# Altium schematic sheet Ethernet.SchDoc: NH Speaker Sensor 16CH 2.3_C
size A3; Revision: 2.3; SheetNumber: 2; SheetTotal: 6
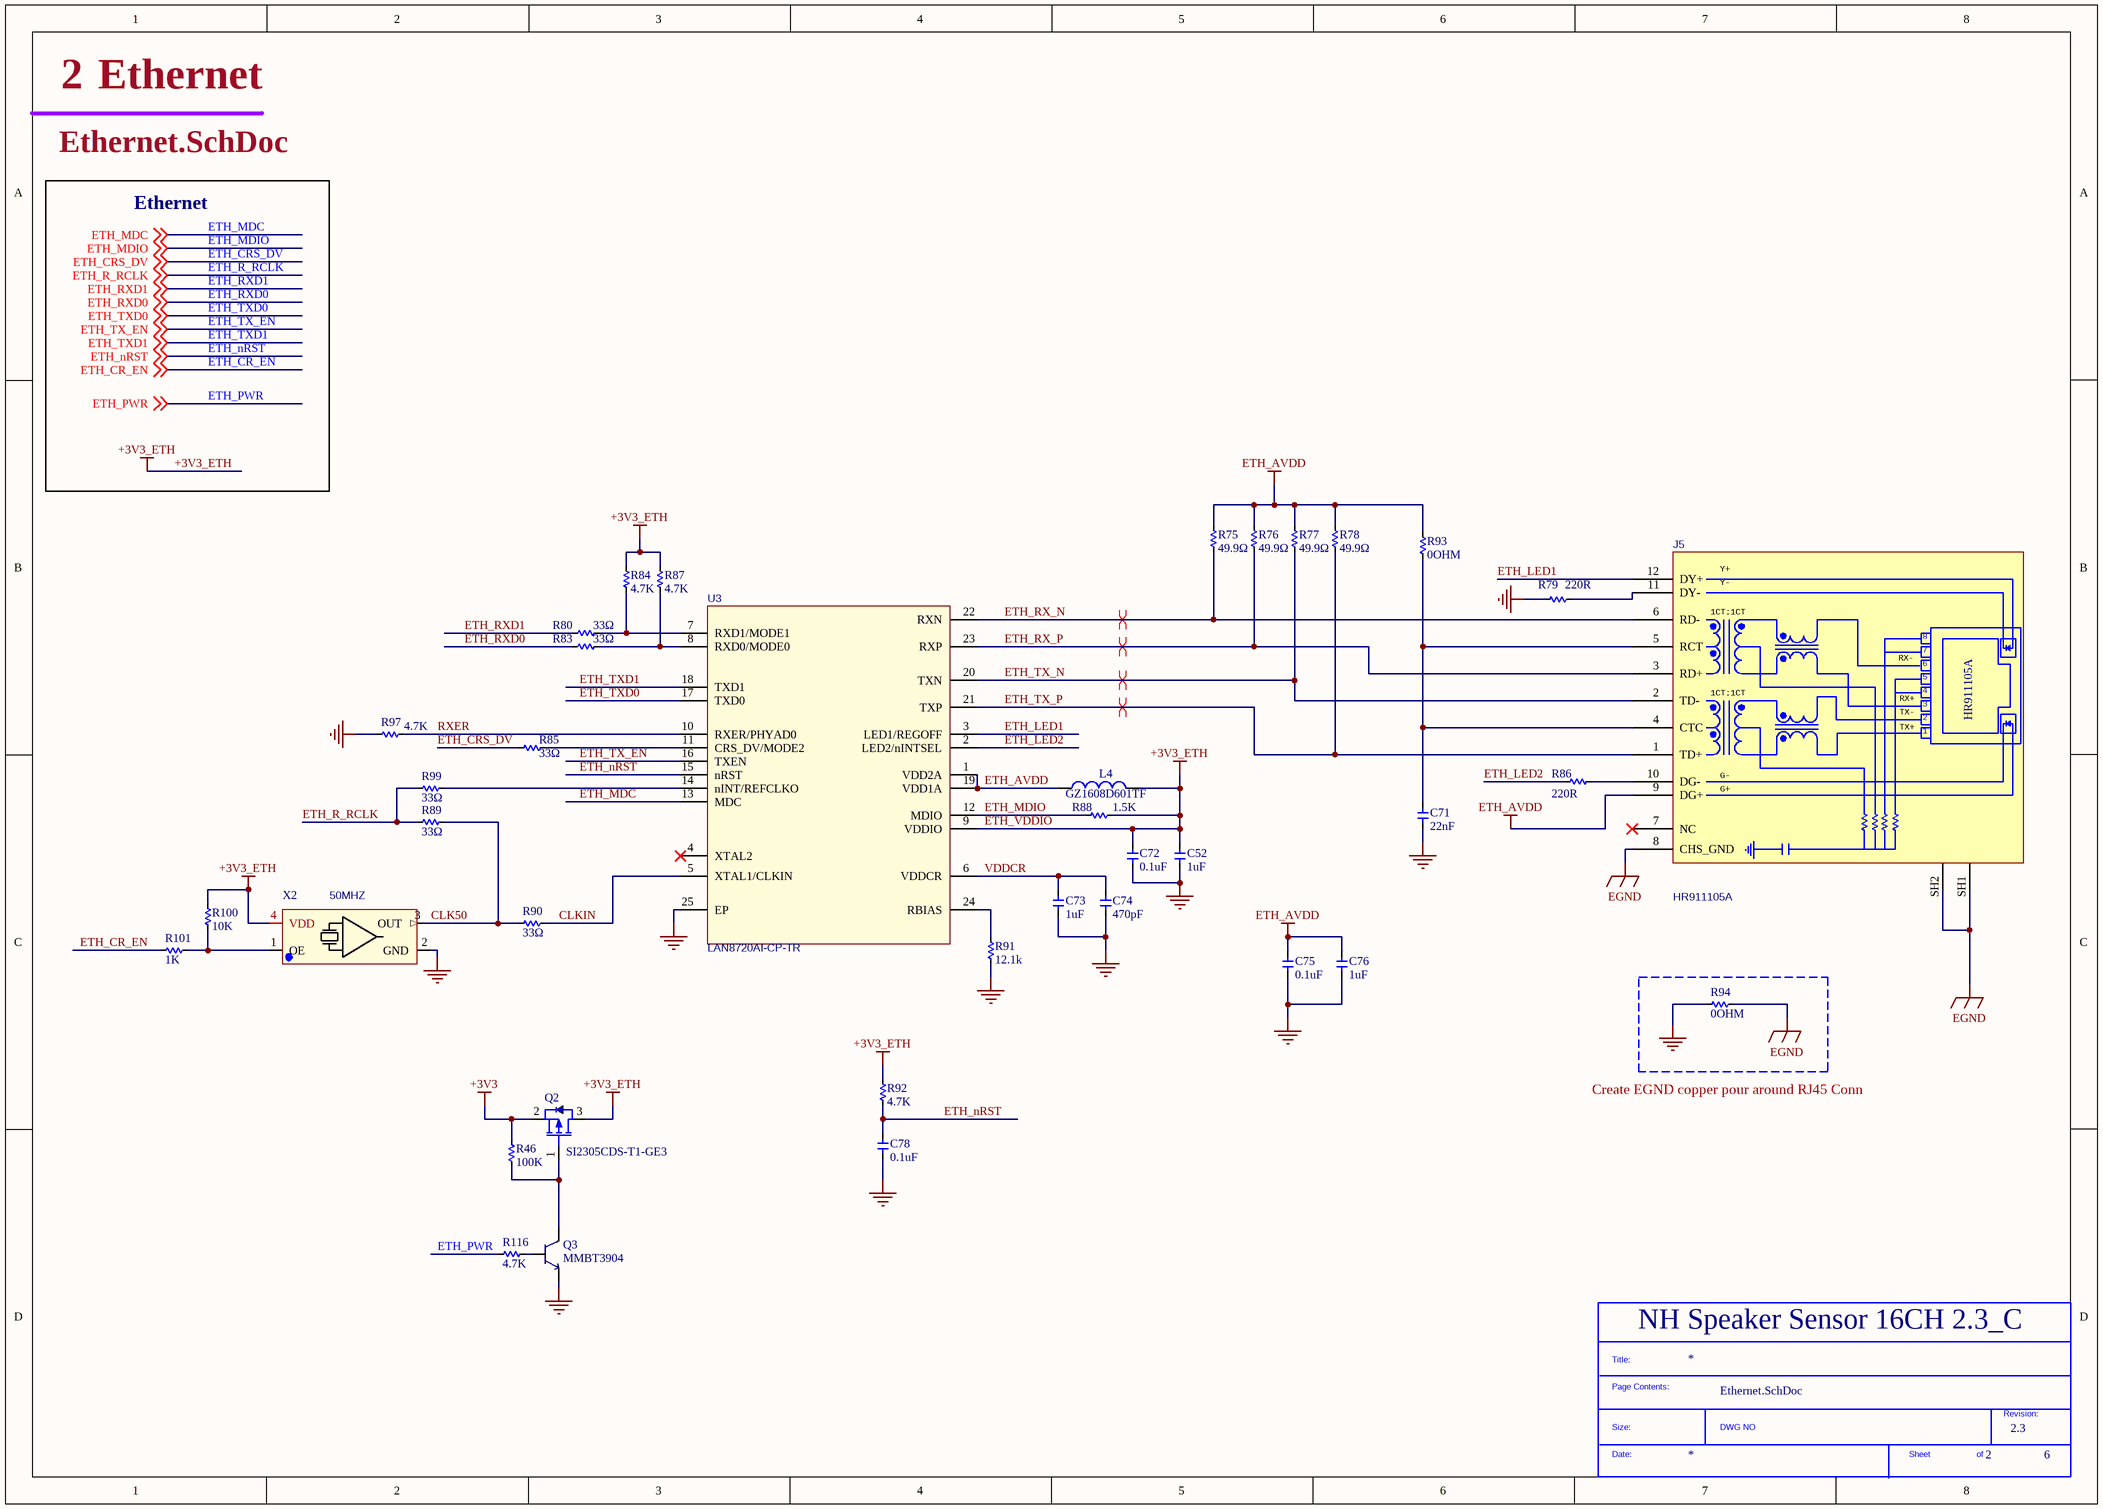
[diagram p0: Ethernet.SchDoc]

## Parts
*?  SDTitleBlock  (value not drawn)  (graphical)
C52  1uF  [C_0603]
C71  22nF  [C_0603]
C72  0.1uF  [C_0603]
C73  1uF  [C_0603]
C74  470pF  [C_0603]
C75  0.1uF  [C_0603]
C76  1uF  [C_0603]
C78  0.1uF  [C_0603]
J5  HR911105A  [RJ45-TH_HR911105A]
L4  GZ1608D601TF  [L_0603]
Q2  SI2305CDS-T1-GE3  [SOT-23-3_L2.9-W1.6-P1.90-LS2.8-BR]
Q3  MMBT3904  [SOT-23-3_L2.9-W1.3-P1.90-LS2.4-BR]
R46  100K  [R_0603]
R75  49.9Ω  [R_0603]
R76  49.9Ω  [R_0603]
R77  49.9Ω  [R_0603]
R78  49.9Ω  [R_0603]
R79  220R  [R_0603]
R80  33Ω  [R_0603]
R83  33Ω  [R_0603]
R84  4.7K  [R_0603]
R85  33Ω  [R_0603]
R86  220R  [R_0603]
R87  4.7K  [R_0603]
R88  1.5K  [R_0603]
R89  33Ω  [R_0603]
R90  33Ω  [R_0603]
R91  12.1k  [R_0603]
R92  4.7K  [R_0603]
R93  0OHM  [R_0603]
R94  0OHM  [R_0603]
R97  4.7K  [R_0603]
R99  33Ω  [R_0603]
R100  10K  [R_0603]
R101  1K  [R_0603]
R116  4.7K  [R_0603]
U3  LAN8720AI-CP-TR  [QFN-24_L4.0-W4.0-P0.50-BL-EP2.6]
X2  50MHZ  [SMD-3225_4P]

## Nets
+3V3: Q2.2(S) R46.1
+3V3_ETH: C52.2 C72.2 L4.2 Q2.3(D) R84.1 R87.1 R88.1 R92.1 R100.1 U3.9(VDDIO) X2.4(VDD)  [also labelled ETH_VDDIO]
EGND: J5.8(CHS_GND) J5.SH1 J5.SH2 R94.1
ETH_AVDD: C75.2 C76.2 J5.9(DG+) L4.1 R75.1 R76.1 R77.1 R78.1 R93.1 U3.1(VDD2A) U3.19(VDD1A)
GND: C52.1 C71.1 C72.1 C73.1 C74.1 C75.1 C76.1 C78.1 Q3.2 R79.2 R91.2 R94.2 R97.2 U3.25(EP) X2.2(GND)
CLK50: R89.1 R90.2 X2.3(OUT)
CLKIN: R90.1 U3.5(XTAL1/CLKIN)
ETH_CR_EN: R101.2 ; off-sheet ETH_CR_EN
ETH_CRS_DV: R85.2 ; off-sheet ETH_CRS_DV
ETH_LED1: J5.12(DY+) U3.3(LED1/REGOFF)
ETH_LED2: R86.2 U3.2(LED2/nINTSEL)
ETH_MDC: U3.13(MDC) ; off-sheet ETH_MDC
ETH_MDIO: R88.2 U3.12(MDIO) ; off-sheet ETH_MDIO
ETH_nRST: C78.2 R92.2 U3.15(nRST) ; off-sheet ETH_nRST
ETH_PWR: R116.2 ; off-sheet ETH_PWR
ETH_R_RCLK: R89.2 R99.2 ; off-sheet ETH_R_RCLK
ETH_RX_N: J5.6(RD-) R75.2 U3.22(RXN)
ETH_RX_P: J5.3(RD+) R76.2 U3.23(RXP)
ETH_RXD0: R83.2 ; off-sheet ETH_RXD0
ETH_RXD1: R80.2 ; off-sheet ETH_RXD1
ETH_TX_EN: U3.16(TXEN) ; off-sheet ETH_TX_EN
ETH_TX_N: J5.2(TD-) R77.2 U3.20(TXN)
ETH_TX_P: J5.1(TD+) R78.2 U3.21(TXP)
ETH_TXD0: U3.17(TXD0) ; off-sheet ETH_TXD0
ETH_TXD1: U3.18(TXD1) ; off-sheet ETH_TXD1
RXER: R97.1 U3.10(RXER/PHYAD0)
VDDCR: C73.2 C74.2 U3.6(VDDCR)
NetC71_2: C71.2 J5.4(CTC) J5.5(RCT) R93.2
NetJ5_10: J5.10(DG-) R86.1
NetJ5_11: J5.11(DY-) R79.1
NetQ2_1: Q2.1(G) Q3.3 R46.2
NetQ3_1: Q3.1 R116.1
NetR80_1: R80.1 R84.2 U3.7(RXD1/MODE1)
NetR83_1: R83.1 R87.2 U3.8(RXD0/MODE0)
NetR85_1: R85.1 U3.11(CRS_DV/MODE2)
NetR91_1: R91.1 U3.24(RBIAS)
NetR99_1: R99.1 U3.14(nINT/REFCLKO)
NetR100_2: R100.2 R101.1 X2.1(OE)

Not connected (* = marked no-connect by the designer): J5 7(NC)*; U3 4(XTAL2)*

## Layout directives
differential pair: ETH_RX_N, ETH_RX_P, ETH_TX_N, ETH_TX_P

## Notes on the sheet
- Ethernet
- Create EGND copper pour around RJ45 Conn
- (in symbol RJ45_HR911105A) Y+; Y-; 1CT:1CT; RX-; RX+; TX-; TX+; G-; G+
- (in symbol SDTitleBlock) Title:; Page Contents:; Revision:; Size:; DWG NO; Date:; Sheet; of

## Library data of the parts
*? = SDTitleBlock: TitleBlock
C52 C73 C76 = CL10A105KB8NNNC: 1UF 50V 0603 ROHS; Manufacturer: Samsung Electro-Mechanics; Manufacturer Part Number: CL10A105KB8NNNC; Package: 0603; LCSC Part Number: C15849; ComponentLink1Description: Digikey Link; ComponentLink1URL: https://www.digikey.com/en/products/detail/samsung-electro-mechanics/CL10A105KB8NNNC/3887518?s=N4IgTCBcDaIMIBkCMAGAgqgrAaQEIA4A5YuEAXQF8g; ComponentLink2Description: LCSC Link; ComponentLink2URL: https://jlcpcb.com/parts/componentSearch?searchTxt=10k%200603; Assembly Type: SMT Assembly
C71 = CL10B223KB8NNNC: 22nF 50V 0603 Multilayer Ceramic Capacitors MLCC - SMD/SMT ROHS; Manufacturer: Samsung Electro-Mechanics; Manufacturer Part Number: CL10B223KB8NNNC; Package: 0603; LCSC Part Number: C21122; ComponentLink1Description: Digikey Link; ComponentLink2Description: LCSC Link; ComponentLink2URL: https://jlcpcb.com/parts/componentSearch?searchTxt=10k%200603; Assembly Type: SMT Assembly
C72 C75 C78 = CC0603KRX7R9BB104: 100NF 50V 0603 ROHS; Manufacturer: YAGEO; Manufacturer Part Number: CC0603KRX7R9BB104; Package: 0603; LCSC Part Number: C14663; ComponentLink1Description: Digikey Link; ComponentLink1URL: https://www.digikey.com/en/products/detail/yageo/CC0603KRX7R9BB104/2103082?s=N4IgTCBcDaIMwEYEFoFwCzuWZA5AIiALoC%2BQA; ComponentLink2Description: LCSC Link; ComponentLink2URL: https://jlcpcb.com/parts/componentSearch?searchTxt=10k%200603; Assembly type: SMT Assembly
C74 = 0603B471K500NT: 470pF 50V 0603 Multilayer Ceramic Capacitors MLCC - SMD/SMT ROHS; Manufacturer: FH(Guangdong Fenghua Advanced Tech); Manufacturer Part Number: 0603B471K500NT; Package: 0603; LCSC Part Number: C1620; ComponentLink1Description: Digikey Link; ComponentLink2Description: LCSC Link; ComponentLink2URL: https://jlcpcb.com/parts/componentSearch?searchTxt=10k%200603; Assembly Type: SMT Assembly
J5 = RJ45_HR911105A: RJ45 12 1 Green - Yellow Through Hole Ethernet Connectors/Modular Connectors (RJ45 RJ11) RoHS; Manufacturer: HANRUN; Manufacturer Part Number: HR911105A; LCSC Part Number: C12074; Package: Through Hole; Assembly Type: Hand Soldering
L4 = FB_GZ1608D601TF: 600Ω @ 100MHz 1 200mA 450mΩ 0603 Ferrite Beads ROHS; Manufacturer: Sunlord; Manufacturer Part Number: GZ1608D601TF; LCSC Part Number: C1002; Package: 0603; Assembly Type: SMT Assembly
Q2 = SI2305CDS-T1-GE3: SI2305CDS-T1-GE3 8V 5.8A 35mΩ@4.5V,4.4A P Channel SOT-23  MOSFETs ROHS; Manufacturer: Vishay Intertech; Manufacturer Part Number: SI2305CDS-T1-GE3; LCSC Part Number: C37577; Package: SOT-23-3; Assembly Type: SMT Assembly
Q3 = MMBT3904: MMBT3904 TRANSISTORS (NPN/PNP) NPN 200MA 40V SOT-23(SOT-23-3) ROHS; Manufacturer: Changjiang Electronics Tech (CJ); Manufacturer Part Number: MMBT3904; LCSC Part Number: C20526; Package: SOT-23-3; Assembly Type: SMT Assembly
R46 = 0603WAF1003T5E: 100KOHMS ±1% 1/10W 0603 ROHS; Manufacturer: Uniroyal Elec; Manufacturer Part Number: 0603WAF1003T5E; LCSC Part Number: C25803; Package: 0603; Assembly Type: SMT Assembly
R75-R78 = 0603WAF499JT5E: 49.9OHM ±1% ±1% 0.1W ±200ppm/℃ 0603 Chip Resistor - Surface Mount RoHS; Manufacturer: Uniroyal Elec; Manufacturer Part Number: 0603WAF499JT5E; LCSC Part Number: C23185; Package: 0603; Assembly Type: SMT Assembly
R79 R86 = 0603WAF2200T5E: 220R 22OHMS ±1% 1/10W 0603 ROHS; Manufacturer: Uniroyal Elec; Manufacturer Part Number: 0603WAF2200T5E; LCSC Part Number: C22962; Package: 0603; Assembly Type: SMT Assembly
R80 R83 R85 R89 R90 R99 = 0603WAF330JT5E: 33OHM ±1% 0.1W ±100ppm/℃ 0603 Chip Resistor - Surface Mount RoHS; Manufacturer: Uniroyal Elec; Manufacturer Part Number: 0603WAF330JT5E; LCSC Part Number: C23140; Package: 0603; Assembly Type: SMT Assembly
R84 R87 R92 R97 R116 = 0603WAF4701T5E: 4.7KOHMS ±1% 1/10W 0603 ROHS; Manufacturer: Uniroyal Elec; Manufacturer Part Number: 0603WAF4701T5E; LCSC Part Number: C23162; Package: 0603; Assembly Type: SMT Assembly
R88 = 0603WAF1501T5E: 1.5KOHMS ±1% 1/10W 0603 ROHS; Manufacturer: Uniroyal Elec; ComponentLink1URL: https://datasheet.ciiva.com/8883/pyu-rc0603-51-rohs-l-4-8883051.pdf?src-supplier=Avnet; ComponentLink1Description: https://datasheet.ciiva.com/8883/pyu-rc0603-51-rohs-l-4-8883051.pdf?src-supplier=Avnet; ComponentLink2URL: https://datasheet.ciiva.com/7746/443971-7746461.pdf?src-supplier=Element14; ComponentLink2Description: https://datasheet.ciiva.com/7746/443971-7746461.pdf?src-supplier=Element14; ComponentLink3URL: https://datasheet.ciiva.com/22747/443971-22747533.pdf?src-supplier=Element14; ComponentLink3Description: https://datasheet.ciiva.com/22747/443971-22747533.pdf?src-supplier=Element14; ComponentLink4URL: https://datasheet.ciiva.com/7746/443971-7746462.pdf?src-supplier=Element14; ComponentLink4Description: https://datasheet.ciiva.com/7746/443971-7746462.pdf?src-supplier=Element14; Manufacturer Part Number: 0603WAF1501T5E; LCSC Part Number: C22843; Package: 0603; Assembly Type: SMT Assembly
R91 = 0603WAF1212T5E: 12.1kΩ ±1% 0.1W ±100ppm/℃ 0603 Chip Resistor - Surface Mount RoHS; Manufacturer: Uniroyal Elec; Manufacturer Part Number: 0603WAF1212T5E; LCSC Part Number: C22864; Package: 0603; Assembly Type: SMT Assembly
R93 R94 = 0603WAF0000T5E: 0OHMS ±1% 1/10W 0603 ROHS; Manufacturer: Uniroyal Elec; Manufacturer Part Number: 0603WAF0000T5E; LCSC Part Number: C21189; Package: 0603; Assembly Type: SMT Assembly
R100 = 0603WAF1002T5E: 10KOHMS ±1% 1/10W 0603 ROHS; Manufacturer: Uniroyal Elec; Manufacturer Part Number: 0603WAF1002T5E; LCSC Part Number: C25804; Package: 0603; Assembly Type: SMT Assembly
R101 = 0603WAF1001T5E: 1KOHMS ±1% 1/10W 0603 ROHS; Manufacturer: Uniroyal Elec; Manufacturer Part Number: 0603WAF1001T5E; LCSC Part Number: C21190; Package: 0603; Assembly Type: SMT Assembly
U3 = LAN8720AI-CP-TR: Ethernet Transceivers 10/100 Base-T/TX PHY RMII 1.6V ~ 3.6V QFN-24_4x4x05P Ethernet ICs RoHS; Manufacturer: SMSC; Manufacturer Part Number: LAN8720AI-CP-TR; LCSC Part Number: C17146; Package: QFN-24_4x4x05P; Assembly Type: SMT Assembly
X2 = HSO321S: HSO321S 50MHZ 3.3V 50PPM -40~+85℃; Manufacturer: HELE(Harmony Elec); Package: SMD-3225_4P; Manufacturer Part Number: HSO321S 50MHZ 3.3V 50PPM -40~+85℃; LCSC Part Number: C160451; Assembly Type: SMT Assembly